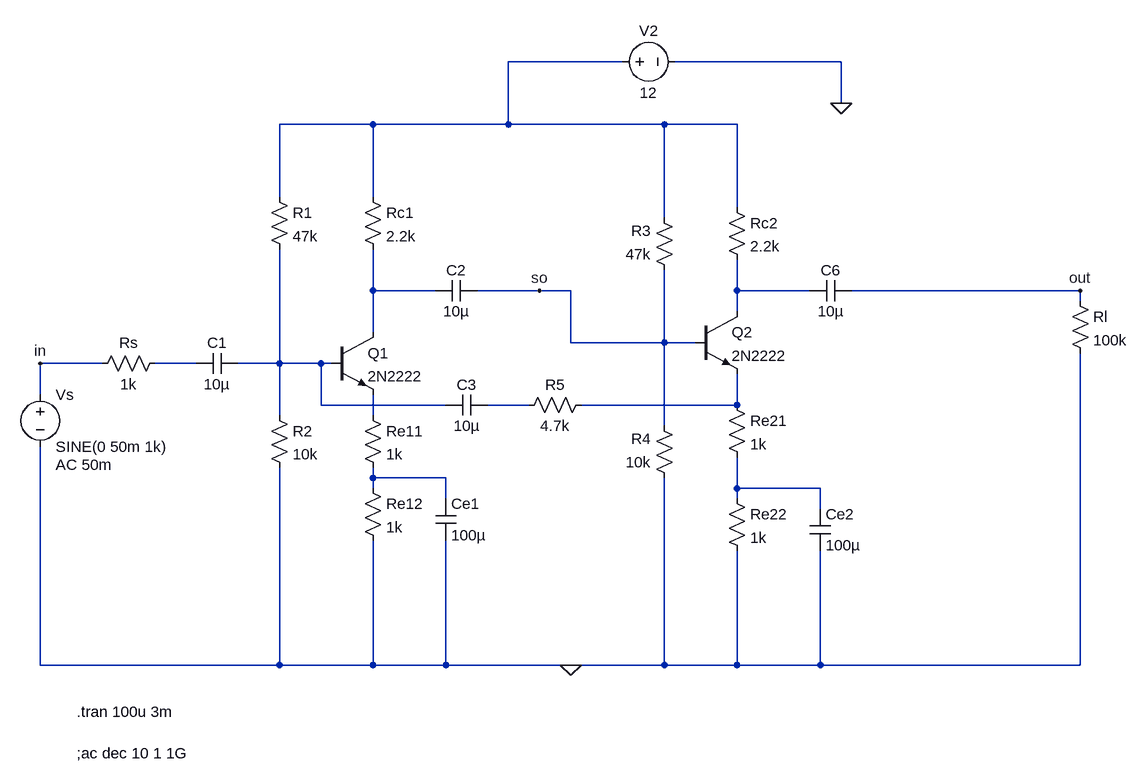
[diagram p0: schematic Current Shunt feedback amplifier.asc]
Current Shunt feedback amplifier.asc, the LTspice schematic file:
Version 4
SHEET 1 1368 976
WIRE 192 -160 16 -160
WIRE 528 -160 272 -160
WIRE 528 -96 528 -160
WIRE -192 -64 -336 -64
WIRE 16 -64 16 -160
WIRE 16 -64 -192 -64
WIRE 256 -64 16 -64
WIRE 368 -64 256 -64
WIRE -336 48 -336 -64
WIRE -192 48 -192 -64
WIRE 368 64 368 -64
WIRE 256 80 256 -64
WIRE -192 192 -192 128
WIRE -96 192 -192 192
WIRE 64 192 -32 192
WIRE 112 192 64 192
WIRE 368 192 368 144
WIRE 480 192 368 192
WIRE 896 192 544 192
WIRE 896 208 896 192
WIRE 368 224 368 192
WIRE -192 256 -192 192
WIRE 112 272 112 192
WIRE 256 272 256 160
WIRE 256 272 112 272
WIRE 304 272 256 272
WIRE -608 304 -704 304
WIRE -464 304 -528 304
WIRE -336 304 -336 128
WIRE -336 304 -400 304
WIRE -272 304 -336 304
WIRE -256 304 -272 304
WIRE -704 352 -704 304
WIRE -272 368 -272 304
WIRE -80 368 -272 368
WIRE 48 368 -16 368
WIRE 368 368 368 320
WIRE 368 368 128 368
WIRE -336 384 -336 304
WIRE -192 384 -192 352
WIRE 256 400 256 272
WIRE -192 480 -192 464
WIRE -80 480 -192 480
WIRE -192 496 -192 480
WIRE 368 496 368 448
WIRE 496 496 368 496
WIRE -80 512 -80 480
WIRE 368 512 368 496
WIRE 496 528 496 496
WIRE -704 768 -704 432
WIRE -336 768 -336 464
WIRE -336 768 -704 768
WIRE -192 768 -192 576
WIRE -192 768 -336 768
WIRE -80 768 -80 576
WIRE -80 768 -192 768
WIRE 112 768 -80 768
WIRE 256 768 256 480
WIRE 256 768 112 768
WIRE 368 768 368 592
WIRE 368 768 256 768
WIRE 496 768 496 592
WIRE 496 768 368 768
WIRE 896 768 896 288
WIRE 896 768 496 768
FLAG 528 -96 0
FLAG 112 768 0
FLAG -704 304 in
FLAG 896 192 out
FLAG 64 192 so
SYMBOL voltage -704 336 R0
WINDOW 123 24 124 Left 2
WINDOW 39 0 0 Left 0
SYMATTR InstName Vs
SYMATTR Value SINE(0 50m 1k)
SYMATTR Value2 AC 50m
SYMBOL res -512 288 R90
WINDOW 0 0 56 VBottom 2
WINDOW 3 32 56 VTop 2
SYMATTR InstName Rs
SYMATTR Value 1k
SYMBOL cap -400 288 R90
WINDOW 0 0 32 VBottom 2
WINDOW 3 32 32 VTop 2
SYMATTR InstName C1
SYMATTR Value 10µ
SYMBOL res -352 368 R0
SYMATTR InstName R2
SYMATTR Value 10k
SYMBOL res -352 32 R0
SYMATTR InstName R1
SYMATTR Value 47k
SYMBOL npn -256 256 R0
SYMATTR InstName Q1
SYMATTR Value 2N2222
SYMBOL res -208 32 R0
SYMATTR InstName Rc1
SYMATTR Value 2.2k
SYMBOL res -208 368 R0
SYMATTR InstName Re11
SYMATTR Value 1k
SYMBOL res -208 480 R0
SYMATTR InstName Re12
SYMATTR Value 1k
SYMBOL cap -96 512 R0
SYMATTR InstName Ce1
SYMATTR Value 100µ
SYMBOL cap -32 176 R90
WINDOW 0 0 32 VBottom 2
WINDOW 3 32 32 VTop 2
SYMATTR InstName C2
SYMATTR Value 10µ
SYMBOL res 272 496 R180
WINDOW 0 36 76 Left 2
WINDOW 3 36 40 Left 2
SYMATTR InstName R4
SYMATTR Value 10k
SYMBOL res 272 176 R180
WINDOW 0 36 76 Left 2
WINDOW 3 36 40 Left 2
SYMATTR InstName R3
SYMATTR Value 47k
SYMBOL npn 304 224 R0
SYMATTR InstName Q2
SYMATTR Value 2N2222
SYMBOL res 352 48 R0
SYMATTR InstName Rc2
SYMATTR Value 2.2k
SYMBOL res 352 352 R0
SYMATTR InstName Re21
SYMATTR Value 1k
SYMBOL res 352 496 R0
SYMATTR InstName Re22
SYMATTR Value 1k
SYMBOL res 880 192 R0
SYMATTR InstName Rl
SYMATTR Value 100k
SYMBOL cap 480 528 R0
SYMATTR InstName Ce2
SYMATTR Value 100µ
SYMBOL cap 544 176 R90
WINDOW 0 0 32 VBottom 2
WINDOW 3 32 32 VTop 2
SYMATTR InstName C6
SYMATTR Value 10µ
SYMBOL voltage 176 -160 R270
WINDOW 0 32 56 VTop 2
WINDOW 3 -32 56 VBottom 2
WINDOW 123 0 0 Left 0
WINDOW 39 0 0 Left 0
SYMATTR InstName V2
SYMATTR Value 12
SYMBOL cap -16 352 R90
WINDOW 0 0 32 VBottom 2
WINDOW 3 32 32 VTop 2
SYMATTR InstName C3
SYMATTR Value 10µ
SYMBOL res 144 352 R90
WINDOW 0 0 56 VBottom 2
WINDOW 3 32 56 VTop 2
SYMATTR InstName R5
SYMATTR Value 4.7k
TEXT -648 904 Left 2 !;ac dec 10 1 1G
TEXT -648 840 Left 2 !.tran 100u 3m

The netlist it stands for:
* Current Shunt feedback amplifier.asc
Vs in 0 SINE(0 50m 1k) AC 50m
Rs N004 in 1k
C1 N005 N004 10µ
R2 N005 0 10k
R1 N001 N005 47k
Q1 N002 N005 N008 0 2N2222
Rc1 N001 N002 2.2k
Re11 N008 N009 1k
Re12 N009 0 1k
Ce1 N009 0 100µ
C2 so N002 10µ
R4 0 so 10k
R3 so N001 47k
Q2 N003 so N007 0 2N2222
Rc2 N001 N003 2.2k
Re21 N007 N010 1k
Re22 N010 0 1k
Rl out 0 100k
Ce2 N010 0 100µ
C6 out N003 10µ
V2 N001 0 12
C3 N006 N005 10µ
R5 N007 N006 4.7k
.model NPN NPN
.model PNP PNP
.lib standard.bjt
;ac dec 10 1 1G
.tran 100u 3m
.backanno
.end